# EAGLE design fb_in16_24VDC_3.2 (EAGLE 5.00)
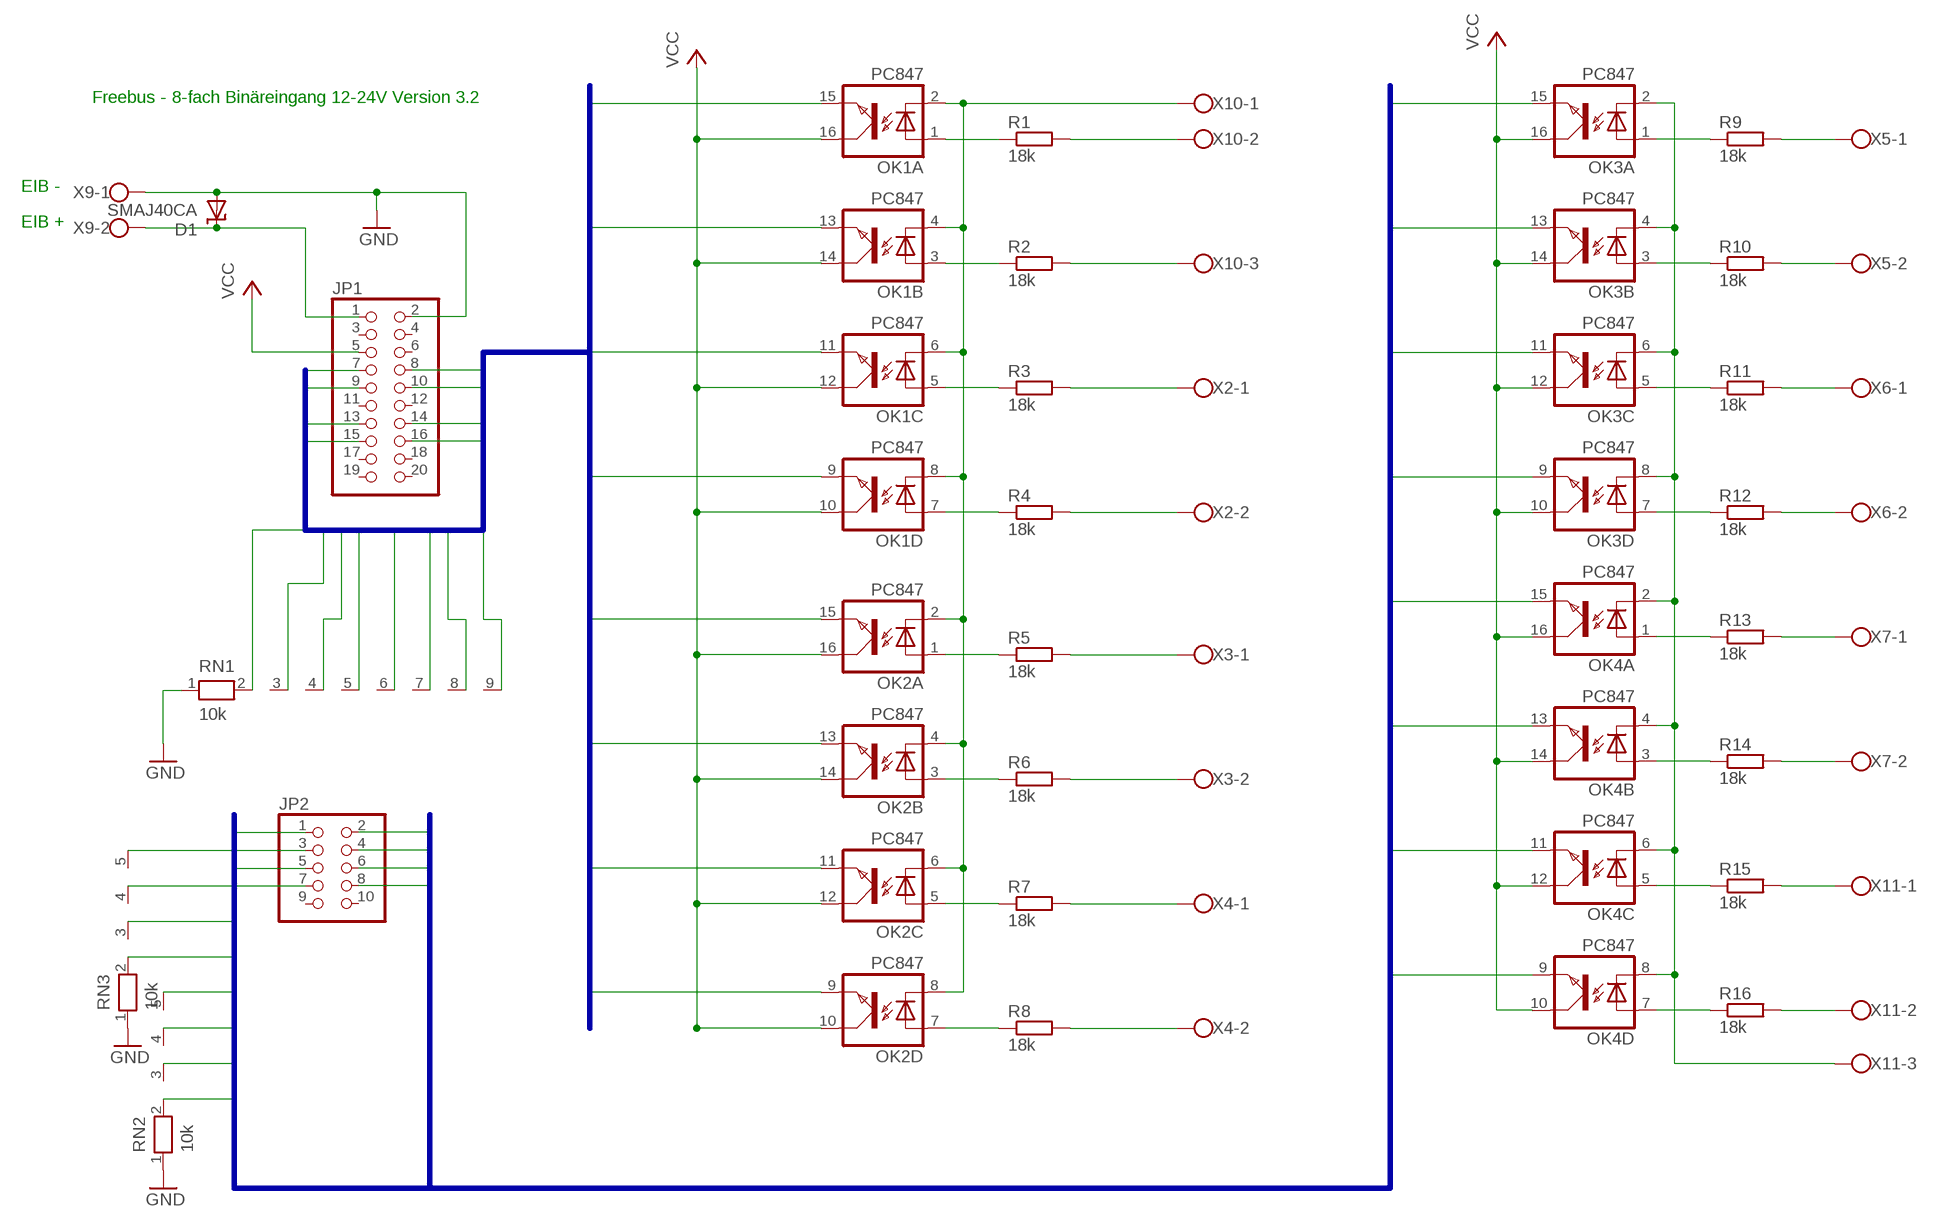
[diagram p0: schematic, sheet 1]

## Parts
D1  SMAJ40CA  SUPPRESSOR-SMBJ  [SMBJ]
JP1  PINHD-2X10  [2X10]
JP2  PINHD-2X5  [2X05]
OK1  PC847  [DIL16]
OK2  PC847  [DIL16]
OK3  PC847  [DIL16]
OK4  PC847  [DIL16]
R1  18k  R-EU_0207/5V  [0207/5V]
R2  18k  R-EU_0207/5V  [0207/5V]
R3  18k  R-EU_0207/5V  [0207/5V]
R4  18k  R-EU_0207/5V  [0207/5V]
R5  18k  R-EU_0207/5V  [0207/5V]
R6  18k  R-EU_0207/5V  [0207/5V]
R7  18k  R-EU_0207/5V  [0207/5V]
R8  18k  R-EU_0207/5V  [0207/5V]
R9  18k  R-EU_0207/5V  [0207/5V]
R10  18k  R-EU_0207/5V  [0207/5V]
R11  18k  R-EU_0207/5V  [0207/5V]
R12  18k  R-EU_0207/5V  [0207/5V]
R13  18k  R-EU_0207/5V  [0207/5V]
R14  18k  R-EU_0207/5V  [0207/5V]
R15  18k  R-EU_0207/5V  [0207/5V]
R16  18k  R-EU_0207/5V  [0207/5V]
RN1  10k  RN08  [RN-9]
RN2  10k  RN04  [RN-5]
RN3  10k  RN04  [RN-5]
X2  W237-02P  [W237-132]
X3  W237-02P  [W237-132]
X4  W237-02P  [W237-132]
X5  W237-02P  [W237-132]
X6  W237-02P  [W237-132]
X7  W237-02P  [W237-132]
X9  W237-102  [W237-102]
X10  W237-03P  [W237-133]
X11  W237-03P  [W237-133]

## Nets
GND: D1.A JP1.2 RN1.1 RN2.1 RN3.1 X9.1
IO1: JP1.7 OK1.15(A:EMIT) RN1.9
IO2: JP1.8 OK1.13(B:EMIT) RN1.8
IO3: JP1.9 OK1.11(C:EMIT) RN1.7
IO4: JP1.10 OK1.9(D:EMIT) RN1.6
IO5: JP1.13 OK2.15(A:EMIT) RN1.5
IO6: JP1.14 OK2.13(B:EMIT) RN1.4
IO7: JP1.15 OK2.11(C:EMIT) RN1.3
IO8: JP1.16 OK2.9(D:EMIT) RN1.2
IO9: JP2.1 OK3.15(A:EMIT) RN2.2
IO10: JP2.2 OK3.13(B:EMIT) RN2.3
IO11: JP2.3 OK3.11(C:EMIT) RN2.4
IO12: JP2.4 OK3.9(D:EMIT) RN2.5
IO13: JP2.5 OK4.15(A:EMIT) RN3.2
IO14: JP2.6 OK4.13(B:EMIT) RN3.3
IO15: JP2.7 OK4.11(C:EMIT) RN3.4
IO16: JP2.8 OK4.9(D:EMIT) RN3.5
N$1: R1.2 X10.2
N$2: R2.2 X10.3
N$3: R3.2 X2.1
N$4: R4.2 X2.2
N$5: D1.C JP1.1 X9.2
N$6: R5.2 X3.1
N$7: R6.2 X3.2
N$8: R7.2 X4.1
N$9: R8.2 X4.2
N$10: R9.2 X5.1
N$11: R10.2 X5.2
N$12: R11.2 X6.1
N$13: R12.2 X6.2
N$14: R13.2 X7.1
N$15: R14.2 X7.2
N$16: R16.2 X11.2
N$17: R15.2 X11.1
N$18: OK1.1(A:A) R1.1
N$19: OK1.3(B:A) R2.1
N$20: OK2.7(D:A) R8.1
N$21: OK2.5(C:A) R7.1
N$22: OK2.3(B:A) R6.1
N$23: OK2.1(A:A) R5.1
N$24: OK1.7(D:A) R4.1
N$25: OK1.5(C:A) R3.1
N$26: OK1.2(A:C) OK1.4(B:C) OK1.6(C:C) OK1.8(D:C) OK2.2(A:C) OK2.4(B:C) OK2.6(C:C) OK2.8(D:C) X10.1
N$27: OK4.7(D:A) R16.1
N$28: OK4.5(C:A) R15.1
N$29: OK4.3(B:A) R14.1
N$30: OK4.1(A:A) R13.1
N$31: OK3.7(D:A) R12.1
N$32: OK3.5(C:A) R11.1
N$33: OK3.3(B:A) R10.1
N$34: OK3.1(A:A) R9.1
N$35: OK3.2(A:C) OK3.4(B:C) OK3.6(C:C) OK3.8(D:C) OK4.2(A:C) OK4.4(B:C) OK4.6(C:C) OK4.8(D:C) X11.3
VCC: JP1.5 OK1.10(D:COL) OK1.12(C:COL) OK1.14(B:COL) OK1.16(A:COL) OK2.10(D:COL) OK2.12(C:COL) OK2.14(B:COL) OK2.16(A:COL) OK3.10(D:COL) OK3.12(C:COL) OK3.14(B:COL) OK3.16(A:COL) OK4.10(D:COL) OK4.12(C:COL) OK4.14(B:COL) OK4.16(A:COL)
Unconnected: JP1.3 JP1.4 JP1.6 JP1.11 JP1.12 JP1.17 JP1.18 JP1.19 JP1.20 JP2.9 JP2.10

## Buses
IO[1..8]
IO[9..16]

## Notes on the sheet
- Freebus - 8-fach Binäreingang 12-24V Version 3.2
- EIB -
- EIB +

## Library data of the parts
D1 = diode:SUPPRESSOR-: Suppressor diode
JP1 = pinhead:PINHD-2X10: PIN HEADER
JP2 = pinhead:PINHD-2X5: PIN HEADER
OK1-OK4 = optocoupler:PC847: SHARP OPTO COUPLER
R1-R16 = rcl:R-EU_: RESISTOR, European symbol
RN1 = resistor-net:RN08: RESISTOR NETWORK
RN2 RN3 = resistor-net:RN04: RESISTOR NETWORK
X2-X7 = con-wago-508:W237-02P: WAGO SREW CLAMP
X9 = con-wago-500:W237-102: WAGO SCREW CLAMP
X10 X11 = con-wago-508:W237-03P: WAGO SREW CLAMP

## Board
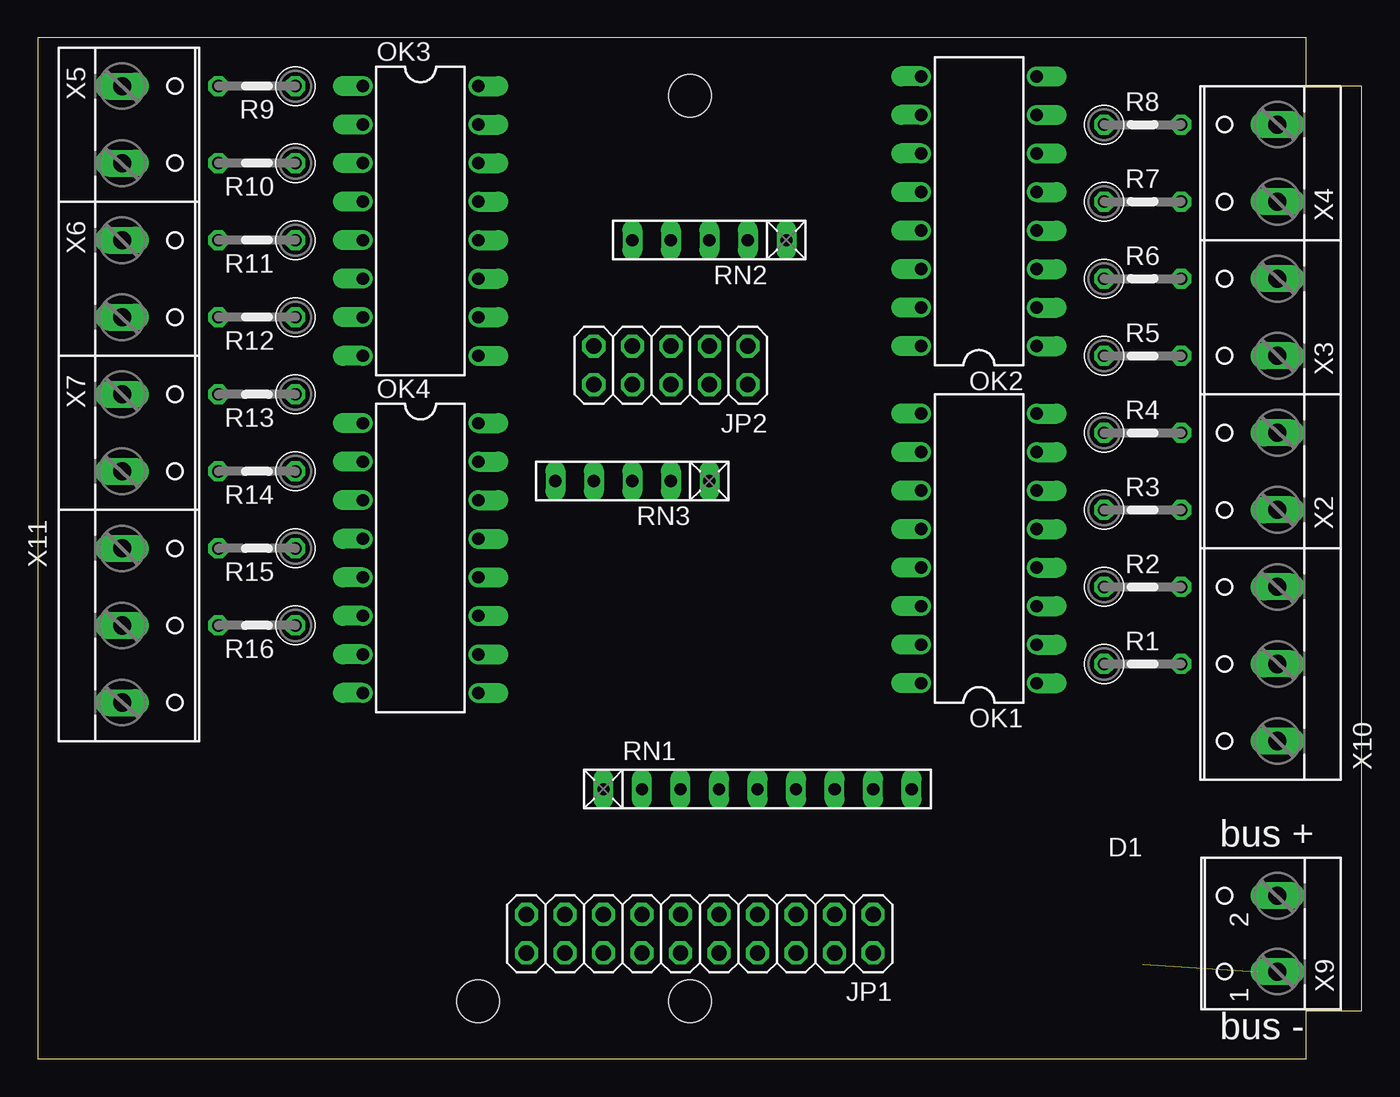
[diagram p1: board, top side]
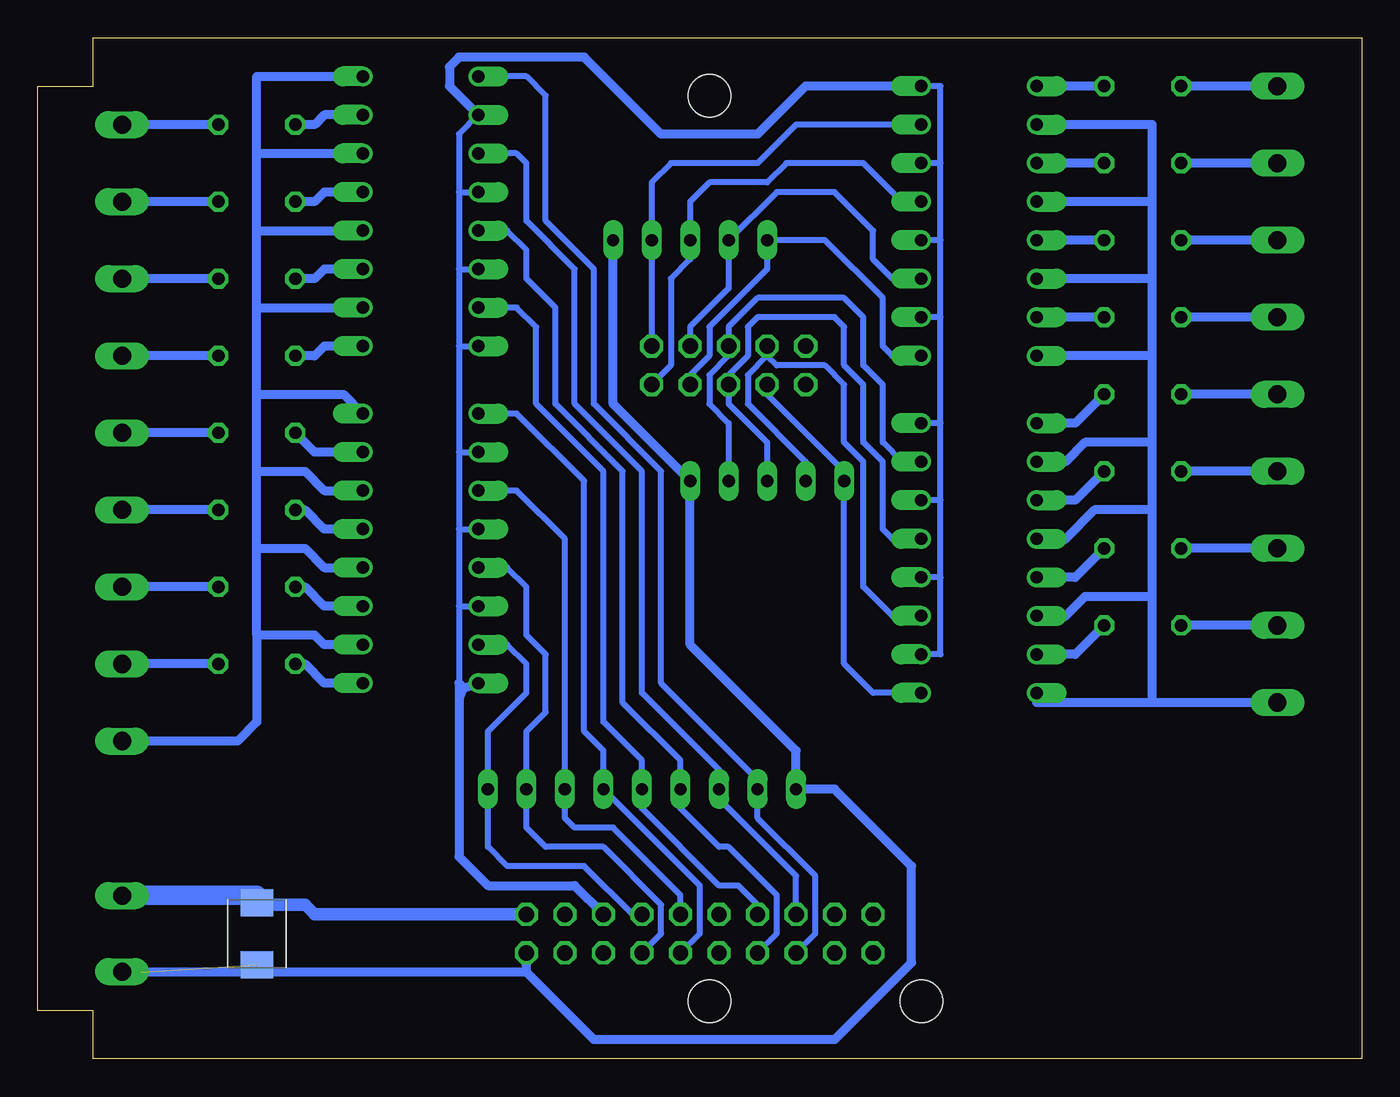
[diagram p2: board, bottom side, seen from below]

Size 87.3 x 67.31 mm. Coordinates in mm from the lower left corner, seen from the top.
Outline: 0,0.01 83.66,0 83.66,3.18 87.3,3.18 87.3,64.13 83.66,64.13 83.66,67.31 0,67.31 0,0.01
Copper layers (1*16): Top 0.035mm / dielectric 1.5mm / Bottom 0.035mm
Design rules "default *": minimum track width 10mil, minimum drill 24mil, track to track 16mil, track to pad 16mil, pad to pad 16mil, via to via 16mil, smd to smd 16mil, copper to edge 20mil, drill to drill 10mil, minimum pad ring 10mil, minimum via ring 8mil, stop-mask expansion 4mil, vias tented up to drill 0mil, thermal gap 10mil
Holes 2.8 mm at 43.02,63.5 29.04,3.81 43.02,3.81

### Footprints (pad centres in the part's own frame; a part is rotated, then mirrored left to right if it is on the bottom)
SMBJ = smd 1.78 x 2.16: A 2.04,0; C -2.03,0
2X10 = drill 1.016 octagon: 1 -11.43,-1.27; 2 -11.43,1.27; 3 -8.89,-1.27; 4 -8.89,1.27; 5 -6.35,-1.27; 6 -6.35,1.27; 7 -3.81,-1.27; 8 -3.81,1.27; 9 -1.27,-1.27; 10 -1.27,1.27; 11 1.27,-1.27; 12 1.27,1.27; 13 3.81,-1.27; 14 3.81,1.27; 15 6.35,-1.27; 16 6.35,1.27; 17 8.89,-1.27; 18 8.89,1.27; 19 11.43,-1.27; 20 11.43,1.27
2X05 = drill 1.016 octagon: 1 -5.08,-1.27; 2 -5.08,1.27; 3 -2.54,-1.27; 4 -2.54,1.27; 5 0,-1.27; 6 0,1.27; 7 2.54,-1.27; 8 2.54,1.27; 9 5.08,-1.27; 10 5.08,1.27
DIL16 = drill 0.813 offset: 1 -8.89,-3.81; 2 -6.35,-3.81; 3 -3.81,-3.81; 4 -1.27,-3.81; 5 1.27,-3.81; 6 3.81,-3.81; 7 6.35,-3.81; 8 8.89,-3.81; 9 8.89,3.81; 10 6.35,3.81; 11 3.81,3.81; 12 1.27,3.81; 13 -1.27,3.81; 14 -3.81,3.81; 15 -6.35,3.81; 16 -8.89,3.81
0207/5V = drill 0.813 octagon: 1 -2.54,0; 2 2.54,0
RN-9 = drill 0.813 long: 1 -10.16,0; 2 -7.62,0; 3 -5.08,0; 4 -2.54,0; 5 0,0; 6 2.54,0; 7 5.08,0; 8 7.62,0; 9 10.16,0
RN-5 = drill 0.813 long: 1 -5.08,0; 2 -2.54,0; 3 0,0; 4 2.54,0; 5 5.08,0
W237-132 = drill 1.194 long: 1 -2.54,-0.635; 2 2.54,-0.635
W237-102 = drill 1.194 long: 1 -2.5,-1.27; 2 2.5,-1.27
W237-133 = drill 1.194 long: 1 -5.08,-0.635; 2 0,-0.635; 3 5.08,-0.635

### Placement (x,y rotation side)
D1  72.86,8.26 270 bottom
JP1  43.65,8.26 180 top
JP2  41.74,45.72 180 top
OK1  62.06,33.66 90 top
OK2  62.06,55.88 90 top
OK3  25.23,55.24 270 top
OK4  25.23,33.02 270 top
R1  72.86,26.04 0 top
R2  72.86,31.12 0 top
R3  72.86,36.2 0 top
R4  72.86,41.27 0 top
R5  72.86,46.35 0 top
R6  72.86,51.43 0 top
R7  72.86,56.52 0 top
R8  72.86,61.59 0 top
R9  14.44,64.14 180 top
R10  14.44,59.05 180 top
R11  14.44,53.98 180 top
R12  14.44,48.89 180 top
R13  14.44,43.81 180 top
R14  14.44,38.73 180 top
R15  14.44,33.66 180 top
R16  14.44,28.58 180 top
RN1  47.46,17.78 0 top
RN2  44.28,53.98 180 top
RN3  39.2,38.1 180 top
X2  81.11,38.73 90 top
X3  81.11,48.89 90 top
X4  81.11,59.05 90 top
X5  6.18,61.59 270 top
X6  6.18,51.43 270 top
X7  6.18,41.27 270 top
X9  80.48,8.26 90 top
X10  81.11,26.04 90 top
X11  6.18,28.58 270 top

### Tracks (layer width: path | path; a pad name or v marks a point on that pad's centre or on a via)
GND  (1 unrouted)
  Bottom 0.406: X9.1 81.75,5.71
  Bottom 0.61: 55.08,5.71 JP1.2 | 55.08,5.71 80.48,5.71 X9.1 | 55.08,5.71 50.63,1.27 34.76,1.27 29.68,6.35 29.68,12.7 34.76,17.78 RN1.1 37.3,20.32 44.28,27.31 RN3.1 49.37,43.18 RN2.1
IO1
  Bottom 0.406: OK1.15 56.35,27.31 55.08,26.04 55.08,24.13 57.62,21.59 RN1.9 57.62,13.97 56.35,12.7 51.27,12.7 48.09,9.53 JP1.7
IO2
  Bottom 0.406: OK1.13 56.35,32.38 55.08,31.12 55.08,27.94 53.81,26.67 53.81,22.86 55.08,21.59 RN1.8 55.08,15.24 53.81,13.97 50,13.97 46.19,10.16 46.19,8.26 JP1.8
IO3
  Bottom 0.406: OK1.11 55.71,37.46 52.54,34.29 RN1.7 52.54,15.88 51.91,15.24 49.37,15.24 44.92,10.79 JP1.9
IO4
  Bottom 0.406: OK1.9 55.71,42.54 51.27,38.1 51.27,21.59 50,20.32 RN1.6 43.65,11.43 43.65,8.26 JP1.10
IO5
  Bottom 0.406: OK2.15 55.71,49.53 54.45,48.26 54.45,43.18 50,38.73 50,22.23 47.46,19.69 RN1.5 47.46,16.51 42.38,11.43 41.11,11.43 39.84,10.16 JP1.13
IO6
  Bottom 0.406: OK2.13 56.35,54.61 55.08,53.34 55.08,51.43 53.17,49.53 53.17,43.18 48.73,38.73 48.73,23.5 44.92,19.69 RN1.4 44.92,16.51 42.38,13.97 41.74,13.97 38.57,10.79 38.57,8.26 JP1.14
IO7
  Bottom 0.406: OK2.11 55.71,59.69 55.08,59.05 55.08,55.24 51.91,52.07 51.91,43.18 47.46,38.73 47.46,24.13 42.38,19.05 RN1.3 42.38,17.15 37.3,12.06 JP1.15
IO8
  Bottom 0.406: OK2.9 55.08,64.77 53.81,63.5 53.81,55.24 50.63,52.07 50.63,43.18 46.19,38.73 46.19,24.77 39.84,18.42 RN1.2 39.84,15.88 36.03,12.06 36.03,8.26 JP1.16
IO9
  Bottom 0.406: OK3.15 37.3,61.59 39.84,59.05 45.55,59.05 46.82,57.78 RN2.2 JP2.1
IO10
  Bottom 0.406: OK3.13 30.31,56.52 32.85,59.05 37.94,59.05 39.2,57.78 43.02,57.78 44.28,56.52 RN2.3 44.28,52.7 45.55,51.43 45.55,45.72 JP2.2
IO11
  Bottom 0.406: OK3.11 30.95,51.43 32.22,52.7 32.22,54.61 34.76,57.15 38.57,57.15 RN2.4 41.74,50.8 44.28,48.26 JP2.3
IO12
  Bottom 0.406: OK3.9 30.95,46.35 31.58,46.99 31.58,50.16 35.39,53.98 RN2.5 39.2,52.07 43.02,48.26 43.02,46.35 44.28,45.09 JP2.4
IO13
  Bottom 0.406: RN3.2 41.74,41.91 43.02,43.18 43.02,45.09 41.74,46.35 JP2.5 41.74,48.26 39.84,50.16 34.12,50.16 32.85,48.89 32.85,45.72 31.58,44.45 31.58,40.64 30.31,39.37 OK4.15
IO14
  Bottom 0.406: RN3.3 39.2,40.64 41.74,43.18 JP2.6 41.74,45.09 40.48,46.35 40.48,48.26 39.84,48.89 34.76,48.89 34.12,48.26 34.12,45.72 32.85,44.45 32.85,40.64 31.58,39.37 31.58,34.92 30.95,34.29 OK4.13
IO15
  Bottom 0.406: 39.2,46.35 JP2.7 | 39.2,46.35 40.48,45.09 40.48,43.18 36.66,39.37 RN3.4 | OK4.11 30.95,29.21 32.85,31.12 32.85,39.37 34.12,40.64 34.12,44.45 35.39,45.72 38.57,45.72 39.2,46.35
IO16
  Bottom 0.406: JP2.8 39.2,43.81 34.12,38.73 RN3.5 34.12,26.04 32.22,24.13 OK4.9
N$1
  Bottom 0.61: R1.2 X10.2
N$2
  Bottom 0.61: R2.2 X10.3
N$3
  Bottom 0.61: R3.2 X2.1
N$4
  Bottom 0.61: R4.2 X2.2
N$5
  Bottom 0.406: 72.86,10.16 D1.C 72.86,10.79
  Bottom 0.813: JP1.1 69.05,9.53 69.69,10.16 72.73,10.16 D1.C
  Bottom 1.27: 72.86,10.79 80.48,10.79 X9.2
N$6
  Bottom 0.61: R5.2 X3.1
N$7
  Bottom 0.61: R6.2 X3.2
N$8
  Bottom 0.61: R7.2 X4.1
N$9
  Bottom 0.61: R8.2 X4.2
N$10
  Bottom 0.61: X5.1 R9.2
N$11
  Bottom 0.61: X5.2 R10.2
N$12
  Bottom 0.61: X6.1 R11.2
N$13
  Bottom 0.61: X6.2 R12.2
N$14
  Bottom 0.61: X7.1 R13.2
N$15
  Bottom 0.61: X7.2 R14.2
N$16
  Bottom 0.61: X11.2 R16.2
N$17
  Bottom 0.61: X11.1 R15.2
N$18
  Bottom 0.61: OK1.1 68.41,24.77 69.69,26.04 R1.1
N$19
  Bottom 0.61: OK1.3 68.41,29.85 69.69,31.12 R2.1
N$20
  Bottom 0.61: OK2.7 68.41,62.23 69.05,61.59 R8.1
N$21
  Bottom 0.61: OK2.5 68.41,57.15 69.05,56.52 R7.1
N$22
  Bottom 0.61: OK2.3 68.41,52.07 69.05,51.43 R6.1
N$23
  Bottom 0.61: OK2.1 68.41,46.99 69.05,46.35 R5.1
N$24
  Bottom 0.61: OK1.7 69.05,40 R4.1
N$25
  Bottom 0.61: OK1.5 68.41,34.92 69.69,36.2 R3.1
N$26
  Bottom 0.61: X10.1 74.13,20.96 72.86,22.23 72.86,27.94 | 72.86,27.94 72.86,33.66 | 72.86,33.66 72.86,38.73 | 72.86,38.73 72.86,43.81 | 72.86,43.81 72.86,49.53 | 72.86,49.53 72.86,54.61 | 72.86,54.61 72.86,59.69 | 72.86,59.69 72.86,64.77 OK2.8 | 72.86,59.69 OK2.6 | 72.86,54.61 OK2.4 | 72.86,49.53 OK2.2 | OK1.8 67.14,43.81 72.86,43.81 | OK1.2 68.41,27.31 69.05,27.94 72.86,27.94 | OK1.6 68.41,37.46 69.69,38.73 72.86,38.73 | OK1.4 68.41,32.38 69.69,33.66 72.86,33.66
N$27
  Bottom 0.61: R16.1 18.88,26.67 OK4.7
N$28
  Bottom 0.61: R15.1 18.88,31.75 OK4.5
N$29
  Bottom 0.61: R14.1 18.88,36.83 OK4.3
N$30
  Bottom 0.61: R13.1 18.88,41.91 OK4.1
N$31
  Bottom 0.61: R12.1 OK3.7
N$32
  Bottom 0.61: R11.1 OK3.5
N$33
  Bottom 0.61: R10.1 OK3.3
N$34
  Bottom 0.61: R9.1 OK3.1
N$35
  Bottom 0.61: X11.3 13.81,23.5 | 13.81,23.5 21.42,23.5 OK4.8 | OK4.6 19.52,29.21 18.25,30.48 13.81,30.48 | 13.81,23.5 13.81,30.48 | OK4.4 19.52,34.29 17.61,36.2 13.81,36.2 | 13.81,30.48 13.81,36.2 | OK4.2 19.52,39.37 18.25,40.64 13.81,40.64 | 13.81,36.2 13.81,40.64 | 13.81,46.35 OK3.8 | 13.81,40.64 13.81,46.35 | 13.81,51.43 OK3.6 | 13.81,46.35 13.81,51.43 | 13.81,56.52 OK3.4 | 13.81,51.43 13.81,56.52 | OK3.2 13.81,61.59 13.81,56.52
VCC
  Bottom 0.406: 27.77,48.89 OK3.10 | 27.77,41.91 27.77,48.89 | 27.77,41.91 OK4.16 | OK2.10 59.52,60.96 59.52,57.15 | 59.52,29.85 59.52,24.77 59.52,23.5 59.21,24.45 | 59.52,34.92 59.52,29.85 | 59.52,40 59.52,34.92 | 59.52,46.99 59.52,40 | 59.52,52.07 59.52,46.99 | 59.52,57.15 59.52,52.07 | 59.52,57.15 OK2.12 | 59.52,52.07 OK2.14 | 59.52,46.99 OK2.16 | 59.52,40 OK1.10 | 59.52,34.92 OK1.12 | 59.52,29.85 OK1.14 | OK3.16 27.77,64.14 27.77,59.05 | 27.77,48.89 27.77,53.98 | 27.77,53.98 27.77,59.05 | 27.77,59.05 OK3.14 | 27.77,53.98 OK3.12 | OK4.10 27.77,26.67 27.77,31.75 | 27.77,31.75 27.77,36.83 | 27.77,36.83 27.77,41.91 | 27.77,36.83 OK4.14 | 27.77,31.75 OK4.12
  Bottom 0.61: OK1.16 59.21,24.45 59.52,24.77 59.52,13.33 57.62,11.43 51.91,11.43 JP1.5 | OK3.16 36.66,64.14 39.84,60.96 46.19,60.96 51.27,66.04 59.52,66.04 60.16,65.41 60.16,64.14 OK2.10

### Text on the board
tPlace: bus + | bus -